# Altium schematic sheet Input.SchDoc
size 297 x 209 mm
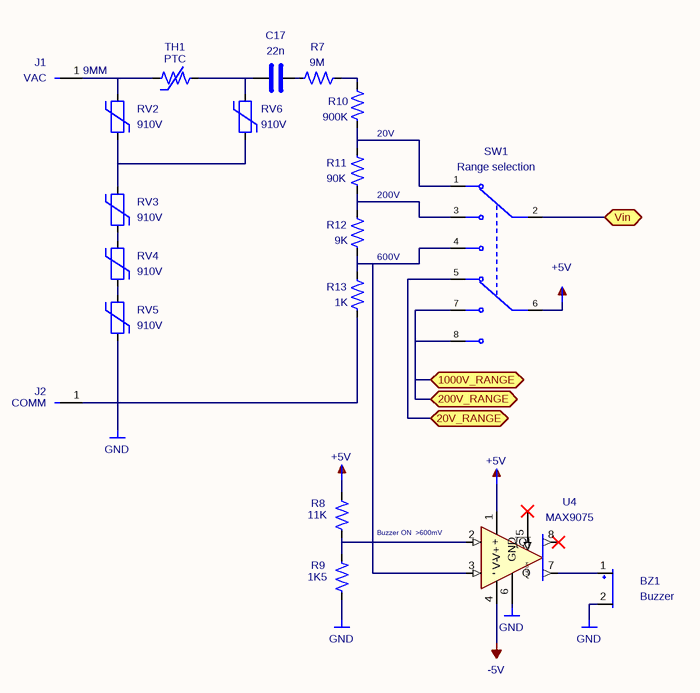
[diagram p0: Input.SchDoc]

## Parts
#PWR15  GND
#PWR016  +5V
#PWR17  GND
#PWR018  +5V
#PWR019  -5V
#PWR20  GND
#PWR021  +5V
#PWR22  GND
BZ1  Buzzer  [Buzzer_12x9.5RM7.6]
C17  22n  [C_Rect_L7.2mm_W11.0mm_P5.00mm_FKS2_FKP2_MKS2_MKP2]
J1  VAC  [TE_350180]
J2  COMM  [TE_350180]
R7  9M  [R_1210_3225Metric]
R8  11K  [R_1206_3216Metric]
R9  1K5  [R_1206_3216Metric]
R10  900K  [R_1210_3225Metric]
R11  90K  [R_1206_3216Metric]
R12  9K  [R_1206_3216Metric]
R13  1K  [R_1206_3216Metric]
RV2  910V  [RV_Disc_D12mm_W3.9mm_P7.5mm]
RV3  910V  [RV_Disc_D12mm_W3.9mm_P7.5mm]
RV4  910V  [RV_Disc_D12mm_W3.9mm_P7.5mm]
RV5  910V  [RV_Disc_D12mm_W3.9mm_P7.5mm]
RV6  910V  [RV_Disc_D12mm_W3.9mm_P7.5mm]
SW1  Range selection  [SW_EG2310]
TH1  PTC  [R_Axial_DIN0414_L11.9mm_D4.5mm_P7.62mm_Vertical]
U4  MAX9075  [SOT-23-8]

## Ports
20V_RANGE (bidir), 200V_RANGE (bidir), 1000V_RANGE (bidir), Vin (bidir)

## Nets
20V_RANGE: SW1.5 ; port 20V_RANGE
1000V_RANGE: SW1.7 SW1.8 ; port 200V_RANGE, port 1000V_RANGE
Vin: SW1.2 ; port Vin
Net#PWR016_1: #PWR016.1(+5V) R8.1
Net#PWR018_1: #PWR018.1(+5V) U4.1(V+)
Net#PWR019_1: #PWR019.1(-5V) U4.4(V-)
Net#PWR021_1: #PWR021.1(+5V) SW1.6
NetBZ1_1: BZ1.1(-) U4.7(Q)
NetC17_1: C17.1 RV6.1 TH1.2
NetC17_2: C17.2 R7.1
NetJ1_1: J1.1(Pin_1) RV2.1 TH1.1
NetJ2_1: J2.1(Pin_1) R13.2 RV5.2
NetR7_2: R7.2 R10.2
NetR8_2: R8.2 R9.1 U4.2(+)
NetR10_1: R10.1 R11.1 SW1.1
NetR11_2: R11.2 R12.1 SW1.3
NetR12_2: R12.2 R13.1 SW1.4 U4.3(-)
NetRV2_2: RV2.2 RV3.1 RV6.2
NetRV3_2: RV3.2 RV4.1
NetRV4_2: RV4.2 RV5.1

Not connected (* = marked no-connect by the designer): #PWR15 1(GND); #PWR17 1(GND); #PWR20 1(GND); #PWR22 1(GND); BZ1 2(+); R9 2; U4 5(LATCH)* 6(GND) 8(~{{Q}})*

## Notes on the sheet
- 9MM
- 20V
- 200V
- 600V
- Buzzer ON  >600mV
- 1
- 2
- 3
- 4
- 5
- 6
- A
- B
- C
- Izbor opsega
- Zujalica za prekomerni napon
- Zaštita ulaza
- D
- Title: Uređaj za merenje efektivne vrednosti AC napona
- File: Input.kicad_sch
- Sheet: /
- Srđan Milkić
- KiCad E.D.A.  kicad (5.1.4)-1
- Size: A4
- Date: 2024-01-19
- Rev: 2
- Id: 1/1

## Library data of the parts
#PWR17 = GND_2: Value: GND
#PWR20 #PWR22 = GND_1: Value: GND
C17 = C: Rated Voltage: 1200V; Value: 22n; Footprint: Capacitor_THT:C_Rect_L7.2mm_W11.0mm_P5.00mm_FKS2_FKP2_MKS2_MKP2
J1 J2 = Conn_01x01_Female: Footprint: priums_lib:TE_350180
  J1: Value: VAC
  J2: Value: COMM
R7-R13 = R_US
  R7: Value: 9M; Footprint: Resistor_SMD:R_1210_3225Metric
  R8: Value: 11K; Footprint: Resistor_SMD:R_1206_3216Metric
  R9: Value: 1K5; Footprint: Resistor_SMD:R_1206_3216Metric
  R10: Value: 900K; Footprint: Resistor_SMD:R_1210_3225Metric
  R11: Value: 90K; Footprint: Resistor_SMD:R_1206_3216Metric
  R12: Value: 9K; Footprint: Resistor_SMD:R_1206_3216Metric
  R13: Value: 1K; Footprint: Resistor_SMD:R_1206_3216Metric
RV2 = Varistor_1: Value: 910V; Footprint: Varistor:RV_Disc_D12mm_W3.9mm_P7.5mm
RV3 = Varistor_2: Value: 910V; Footprint: Varistor:RV_Disc_D12mm_W3.9mm_P7.5mm
RV4 = Varistor_3: Value: 910V; Footprint: Varistor:RV_Disc_D12mm_W3.9mm_P7.5mm
RV5 = Varistor: Value: 910V; Footprint: Varistor:RV_Disc_D12mm_W3.9mm_P7.5mm
RV6 = Varistor_4: Value: 910V; Footprint: Varistor:RV_Disc_D12mm_W3.9mm_P7.5mm
SW1 = EG2310: MF: E-Switch; Description: \nSlide Switch DP3T Through Hole, Right Angle\n; MAXIMUM_PACKAGE_HEIGHT: 4.7mm; Package: None; Price: None; Check_prices: https://www.snapeda.com/parts/EG2310/E-Switch/view-part/?ref=eda; STANDARD: Manufacturer Recommendations; PARTREV: -; SnapEDA_Link: https://www.snapeda.com/parts/EG2310/E-Switch/view-part/?ref=snap; MP: EG2310; Purchase-URL: https://www.snapeda.com/api/url_track_click_mouser/?unipart_id=396456&manufacturer=E-Switch&part_name=EG2310&search_term=None; MANUFACTURER: E-Switch; Availability: In Stock; SNAPEDA_PN: EG2310; Value: Range selection; Footprint: priums_lib:SW_EG2310
TH1 = Thermistor_US: Value: PTC; Footprint: Resistor_THT:R_Axial_DIN0414_L11.9mm_D4.5mm_P7.62mm_Vertical
U4 = AD8561: Value: MAX9075; Footprint: Package_TO_SOT_SMD:SOT-23-8
#PWR15 = GND: Value: GND
#PWR016 #PWR018 #PWR021 = +5V: Value: +5V
#PWR019 = -5V: Value: -5V
BZ1 = Buzzer: Value: Buzzer; Footprint: Buzzer_Beeper:Buzzer_12x9.5RM7.6